# Altium schematic sheet E12_Bus.SchDoc
size A; SheetNumber: 2; SheetTotal: 2
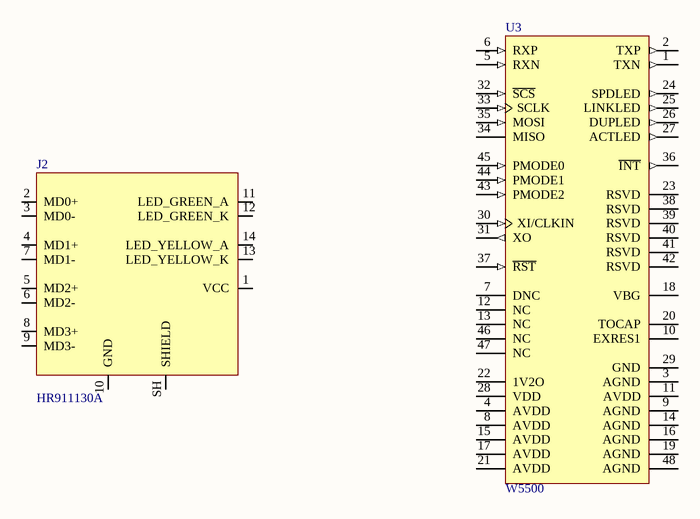
[diagram p0: E12_Bus.SchDoc]

## Parts
J2  HR911130A  [HR911130A]
U3  W5500  [WIZ-W5500-LQFP-48_M]

## Nets

Not connected (* = marked no-connect by the designer): J2 1(VCC) 2(MD0+) 3(MD0-) 4(MD1+) 5(MD2+) 6(MD2-) 7(MD1-) 8(MD3+) 9(MD3-) 10(GND) 11(LED_GREEN_A) 12(LED_GREEN_K) 13(LED_YELLOW_K) 14(LED_YELLOW_A) SH(SHIELD); U3 1(TXN) 2(TXP) 3(AGND) 4(AVDD) 5(RXN) 6(RXP) 7(DNC) 8(AVDD) 9(AGND) 10(EXRES1) 11(AVDD) 12(NC) 13(NC) 14(AGND) 15(AVDD) 16(AGND) 17(AVDD) 18(VBG) 19(AGND) 20(TOCAP) 21(AVDD) 22(1V2O) 23(RSVD) 24(SPDLED) 25(LINKLED) 26(DUPLED) 27(ACTLED) 28(VDD) 29(GND) 30(XI/CLKIN) 31(XO) 32(~{SCS}) 33(SCLK) 34(MISO) 35(MOSI) 36(~{INT}) 37(~{RST}) 38(RSVD) 39(RSVD) 40(RSVD) 41(RSVD) 42(RSVD) 43(PMODE2) 44(PMODE1) 45(PMODE0) 46(NC) 47(NC) 48(AGND)

## Library data of the parts
J2 = CMP-006-000011-1: 100/1000Base-T Magnetics Single-Port RJ45 Connector with Integrated Magnetics and LEDs; Manufacturer: Hanrun; Design Item ID: HR911130A; Manufacturer Part Number: HR911130A; Source: Schematic-Lib-PhilsLab.SchLib
U3 = CMP-020-00020-3: Hardwired TCP/IP Embedded Ethernet Controller, 3.3 V, 25 MHz, -40 to 85 degC, 48-Pin LQFP, RoHS, Tray; Manufacturer: WIZnet; Interface: SPI; Min Supply Voltage: 2.97V; Max Supply Voltage: 3.63V; Package Quantity: 250; Package Description: 48-Pin Low-profile Quad Flat Package, Body 7.00 x 7.00 mm, Pitch 0.50 mm; Package Reference: LQFP-48; Case/Package: LQFP; RoHS Compliant: True; Mounting Technology: SM; Datasheet URL: http://wizwiki.net/wiki/lib/exe/fetch.php?media=products:w5500:w5500_ds_v106e_141230.pdf; Manufacturer URL: http://www.wiznet.co.kr/; Packaging: Tray; Min Operating Temperature: -40°C; Pins: 48; Datasheet Version: Rev. 1.0.6, 12/2014; Max Operating Temperature: 85°C